# EAGLE design photodiode (EAGLE 6.5.0)
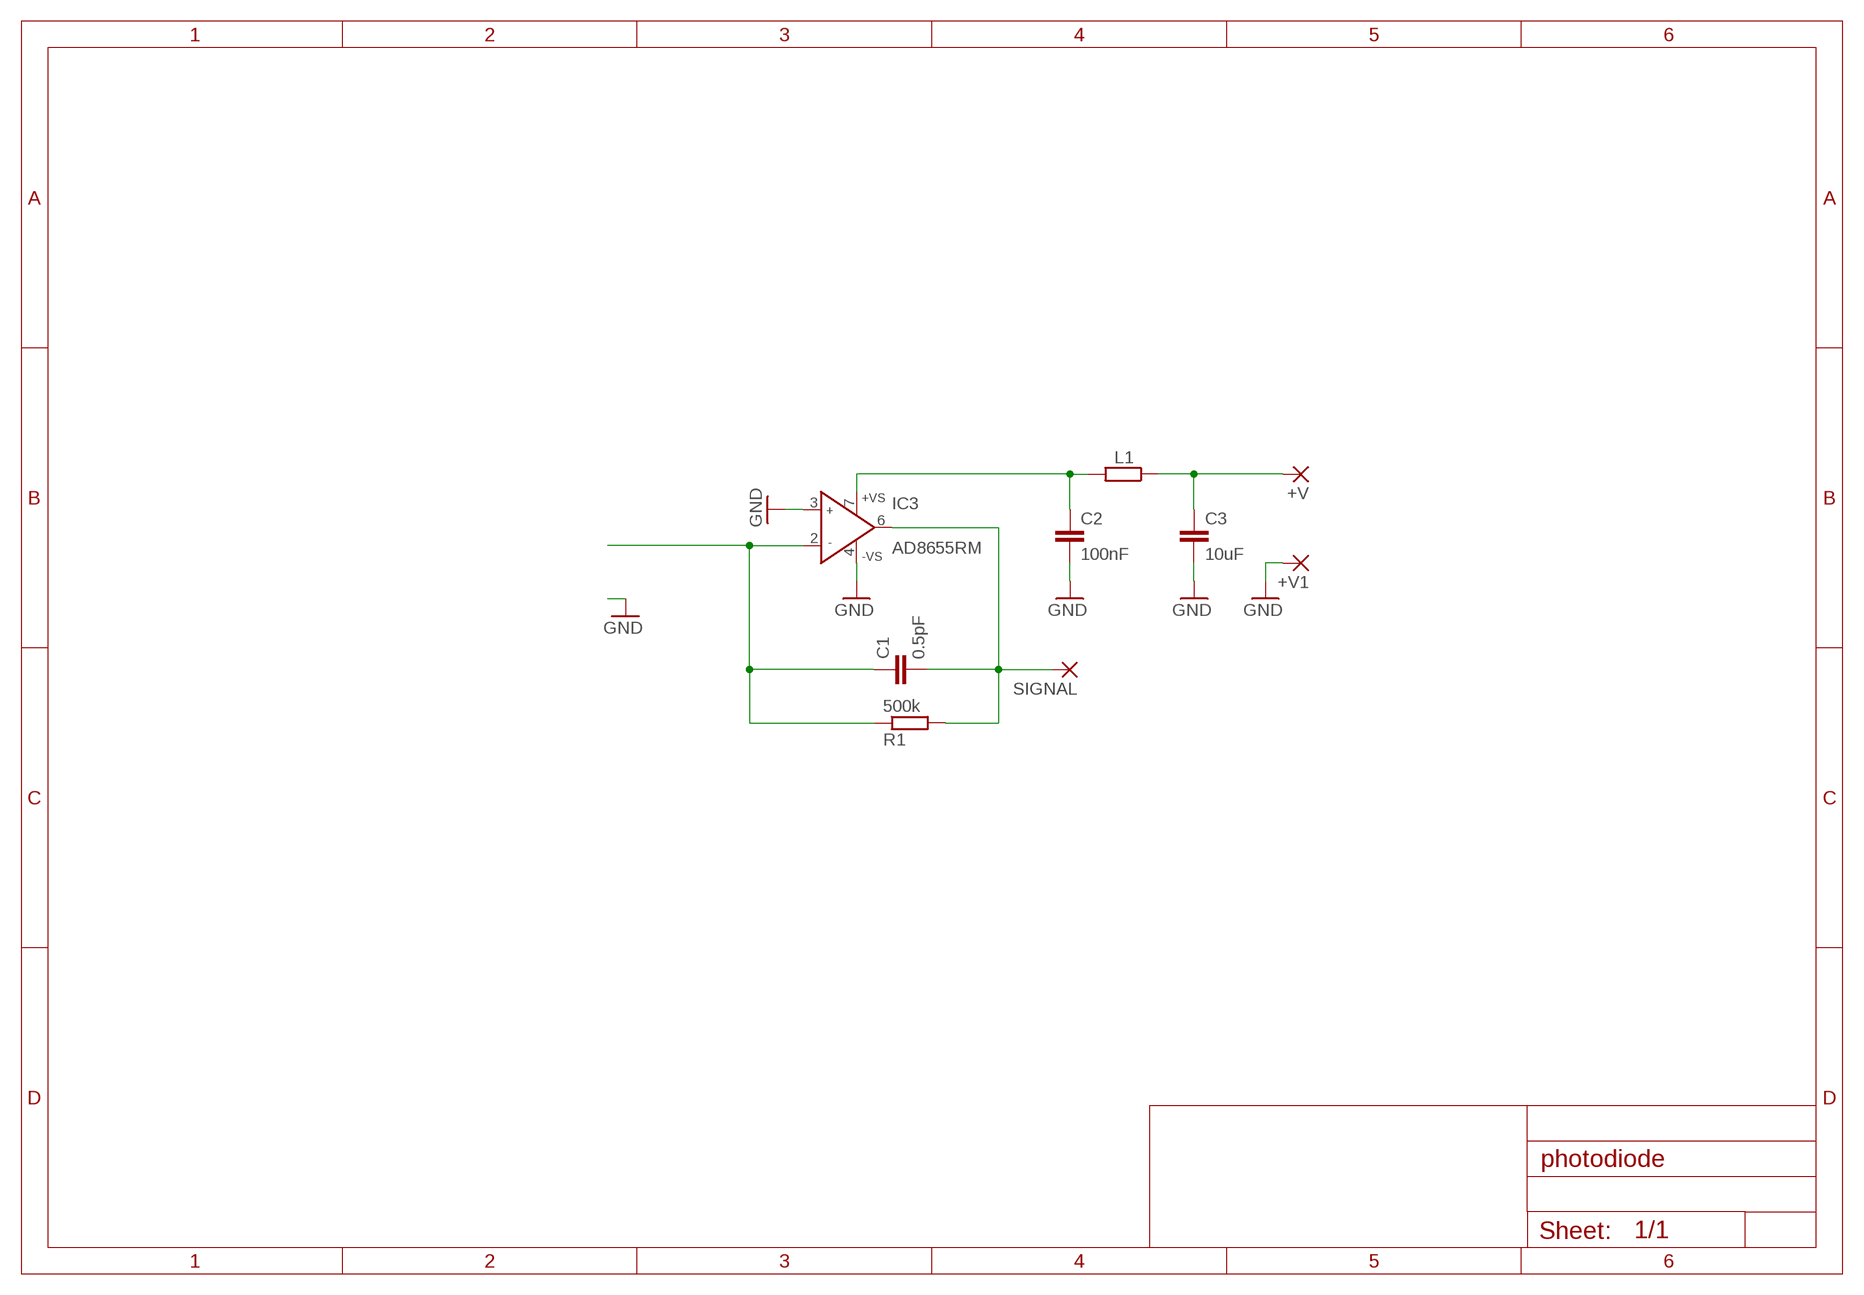
[diagram p0: schematic, sheet 1]

## Parts
+V  WIREPADSMD1,27-254  [SMD1,27-2,54]
+V1  WIREPADSMD1,27-254  [SMD1,27-2,54]
C1  0.5pF  C-EUC0402  [C0402]
C2  100nF  C-EUC0402  [C0402]
C3  10uF  C-EUC0603  [C0603]
IC3  AD8655RM  [MSOP08]
L1  1k@100M  R-EU_R0402  [R0402]
R1  500k  R-EU_R0402  [R0402]
SIGNAL  WIREPADSMD1,27-254  [SMD1,27-2,54]

## Nets
AMP_OUT: C1.2 IC3.6(OUT) R1.2 SIGNAL.1(P)
GND: +V1.1(P) C2.2 C3.2 IC3.3(IN+) IC3.4(-VS)
KATODE: C1.1 IC3.2(IN-) R1.1
SUPPLY: C2.1 IC3.7(+VS) L1.2
SUPPLY_INPUT: +V.1(P) C3.1 L1.1

## Library data of the parts
+V +V1 SIGNAL = wirepad:WIREPAD: Wire PAD connect wire on PCB
C1-C3 = rcl:C-EU: CAPACITOR, European symbol
IC3 = analog-devices:AD8655: Low Noise, Precision CMOS Amplifier Source: http://www.analog.com/static/imported-files/data_sheets/AD8655_8656.pdf; MF: ALTERA CORPORATION; MPN: AD8655ARZ; OC_FARNELL: 1078267; OC_NEWARK: 59K7052
L1 R1 = rcl:R-EU_: RESISTOR, European symbol

## Board
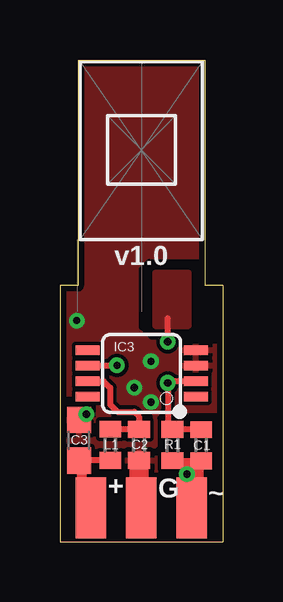
[diagram p1: board, top side]
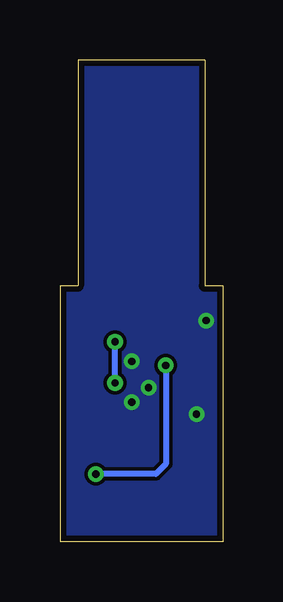
[diagram p2: board, bottom side, seen from below]

Size 6.8 x 20.09 mm. Coordinates in mm from the lower left corner, seen from the top.
Outline: 0.75,20.09 0.75,10.68 0,10.68 0,0 6.8,0 6.8,10.68 6.05,10.68 6.05,20.09 0.75,20.09
Copper layers (1*16): Top 0.018mm / dielectric 1.55mm / Bottom 0.018mm
Design rules "eC_2Layer_PClass6_BaseCopperO18_eCDefault *": minimum track width 0.15mm, minimum drill 0.3mm, track to track 6mil, track to pad 6mil, pad to pad 6mil, via to via 6mil, smd to smd 0mil, copper to edge 10mil, drill to drill 0.35mm, minimum pad ring 0.175mm, minimum via ring 0.175mm, stop-mask expansion 0mil, vias tented up to drill 0.45mm, thermal gap 0.2mm
tRestrict: 16 lines

### Footprints (pad centres in the part's own frame; a part is rotated, then mirrored left to right if it is on the bottom)
SMD1,27-2,54 = smd 1.27 x 2.54: 1 0,0
C0402 = smd 0.7 x 0.9: 1 -0.65,0; 2 0.65,0
C0603 = smd 1.1 x 1: 1 -0.85,0; 2 0.85,0
MSOP08 = smd 0.4 x 1: 1 -0.976,-2.263; 2 -0.326,-2.263; 3 0.324,-2.263; 4 0.974,-2.263; 5 0.974,2.262; 6 0.324,2.262; 7 -0.326,2.262; 8 -0.976,2.262
R0402 = smd 0.7 x 0.9: 1 -0.65,0; 2 0.65,0

### Placement (x,y rotation side)
+V  1.3,1.42 0 top
+V1  3.4,1.42 0 top
C1  5.9,4.02 270 top
C2  3.3,4.04 270 top
C3  0.8,4.23 90 top
IC3  3.41,7.02 90 top
L1  2.1,4.04 90 top
R1  4.7,4.03 270 top
SIGNAL  5.5,1.42 0 top

### Tracks (layer width: path | path; a pad name or v marks a point on that pad's centre or on a via)
AMP_OUT  (via drill 0.3)
  Top 0.254: 5.79,3.38 C1.2 | IC3.6 v2.37,7.34 v2.38,7.35 | 4.6,3.38 R1.2
  Top 0.305: v5.3,2.82 5.3,3.32 | 5.3,3.32 4.66,3.32 R1.2 | 5.3,3.32 5.75,3.32 C1.2
  Top 0.406: 5.79,3.38 5.79,1.31 SIGNAL.1
  Bottom 0.254: v2.38,7.35 2.38,3.24 2.8,2.82 v5.3,2.82
GND  (via drill 0.3)
  Top 0.813: C2.2 3.3,1.12 +V1.1
  other vias: 3.1,6.42 3.8,5.82 3.8,7.52 0.7,9.22 1.1,5.32
  pour Top (rank 2): 10.5,2.8 -5.5,2.8 -5.5,26.22 10.5,26.22
  pour Bottom: 10.5,-0.7 -5.5,-0.7 -5.5,26.22 10.5,26.16
KATODE  (via drill 0.3)
  Top 0.254: R1.1 | IC3.2 4.57,6.69 v4.5,6.62 4.5,4.68 R1.1 | C1.1 5.8,4.68 R1.1 | v4.5,8.34 4.5,9.32
  Bottom 0.254: v4.5,6.62 v4.5,8.34
  pour Top: 3.98,9.01 5.38,9.01 5.38,11.21 3.98,11.21
SUPPLY
  Top 0.254: IC3.7 1.83,6.69 2.1,6.42 2.1,5.72 2.4,5.42 3.1,5.42 3.3,5.22 C2.1 L1.2
SUPPLY_INPUT
  Top 0.254: L1.1 1.21,3.39 C3.1
  Top 0.406: 1,1.32 +V.1 | 0.9,1.02 +V.1 | C3.1 0.9,3.28 0.9,1.82 +V.1

### Text on the board
tPlace: v1.0 | + | G | ~